# EAGLE design schematic (EAGLE 6.4)
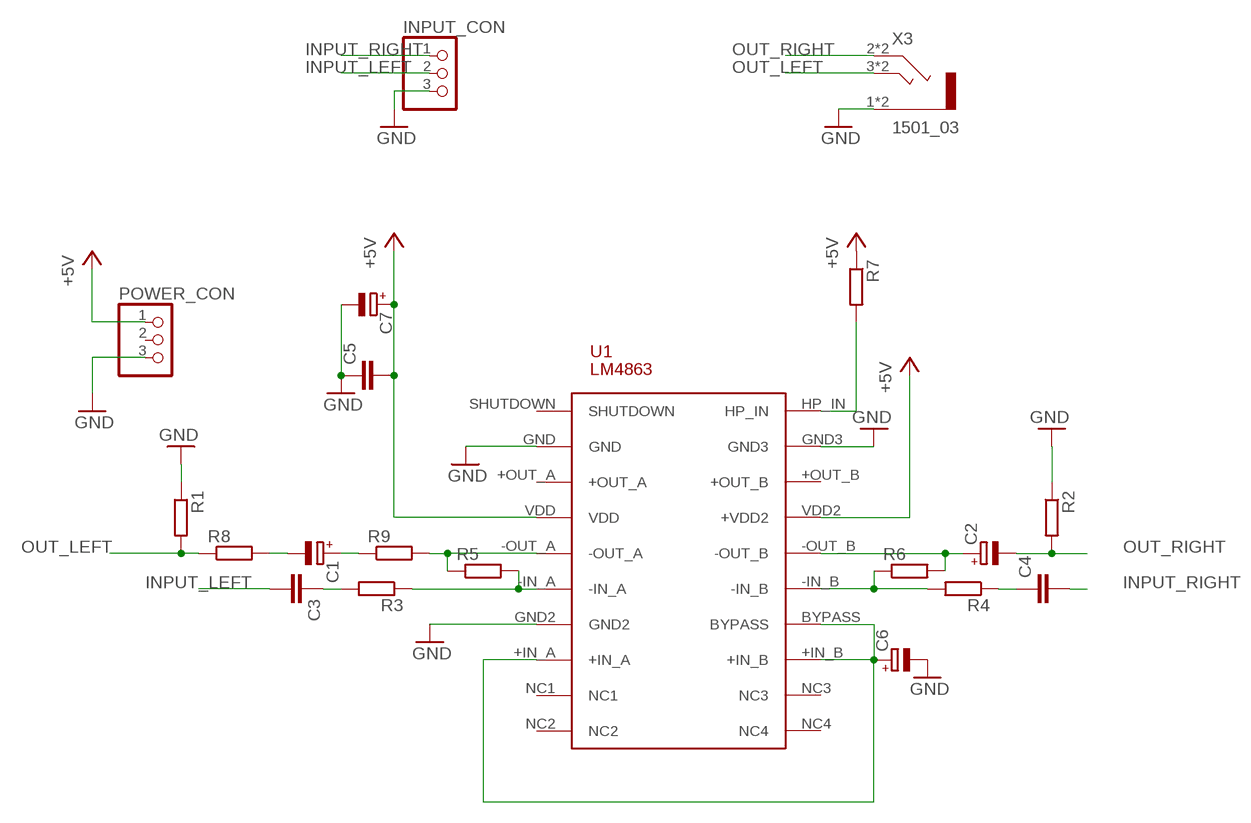
[diagram p0: schematic, sheet 1]

## Parts
C1  CPOL-EUE2.5-7  [E2,5-7]
C2  CPOL-EUE2.5-7  [E2,5-7]
C3  C-EU050-035X075  [C050-035X075]
C4  C-EU050-035X075  [C050-035X075]
C5  C-EU050-024X044  [C050-024X044]
C6  CPOL-EUE2.5-7  [E2,5-7]
C7  CPOL-EUE2.5-7  [E2,5-7]
INPUT_CON  PINHD-1X3CB  [1X03-CLEANBIG]
POWER_CON  PINHD-1X3  [1X03]
R1  R-EU_0207/2V  [0207/2V]
R2  R-EU_0207/10  [0207/10]
R3  R-EU_0207/10  [0207/10]
R4  R-EU_0207/2V  [0207/2V]
R5  R-EU_0204/2V  [0204V]
R6  R-EU_0207/2V  [0207/2V]
R7  R-EU_0207/10  [0207/10]
R8  R-EU_0204/7  [0204/7]
R9  R-EU_0204/7  [0204/7]
U1  LM4863  [TSSOP20]
X3  1501_03  [1501_03]

## Nets
+5V: C5.2 C7.+ POWER_CON.1 R7.1 U1.VDD U1.VDD2(+VDD2)
GND: C5.1 C6.- C7.- INPUT_CON.3 POWER_CON.3 R1.1 R2.1 U1.GND U1.GND2 U1.GND3 X3.1 X3.11
INPUT_LEFT: C3.2 INPUT_CON.2
INPUT_RIGHT: C4.2 INPUT_CON.1
N$1: C2.+ R6.2 U1.-OUT_B
N$2: R5.1 R9.2 U1.-OUT_A
N$3: C3.1 R3.2
N$4: R3.1 R5.2 U1.-IN_A
N$5: R4.2 R6.1 U1.-IN_B
N$6: C4.1 R4.1
N$7: C6.+ U1.+IN_A U1.+IN_B U1.BYPASS
N$8: R7.2 U1.HP_IN
N$9: C1.- R8.2
N$10: C1.+ R9.1
OUT_LEFT: R1.2 R8.1 X3.3 X3.33
OUT_RIGHT: C2.- R2.2 X3.2 X3.22
Unconnected: POWER_CON.2 U1.+OUT_A U1.+OUT_B U1.NC1 U1.NC2 U1.NC3 U1.NC4 U1.SHUTDOWN

## Library data of the parts
C1 C2 C7 = rcl:CPOL-EU: POLARIZED CAPACITOR, European symbol
C3-C5 = resistor:C-EU: CAPACITOR, European symbol
C6 = resistor:CPOL-EU: POLARIZED CAPACITOR, European symbol
INPUT_CON POWER_CON = adafruit:PINHD-1X3: PIN HEADER
R1-R9 = resistor:R-EU_: RESISTOR, European symbol
U1 = mylib:LM4863
X3 = mylib:1501_03: Klinkensteckverbinder nach JISC 6560, 2,5 mm Jack connectors according to JISC 6560, 2.5 mm Source: http://www.lumberg.com/Produkte/PDFs/1501_03.pdf; OC_FARNELL: 1200127; OC_NEWARK: unknown

## Board
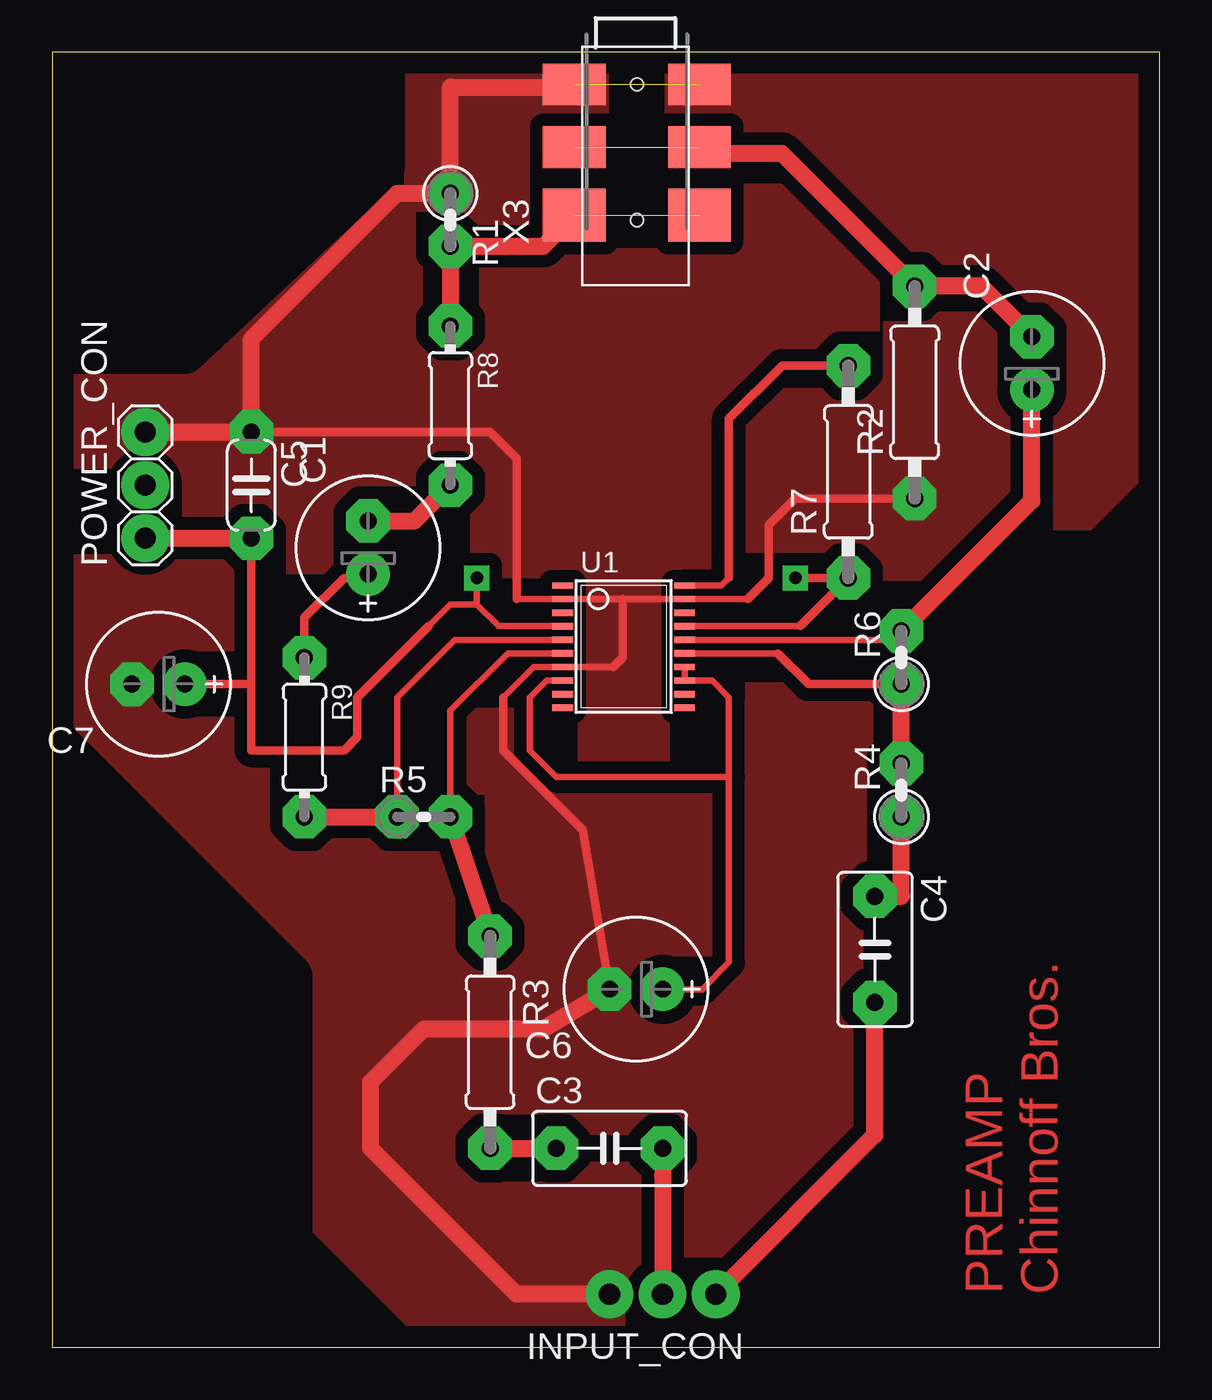
[diagram p1: board, top side]
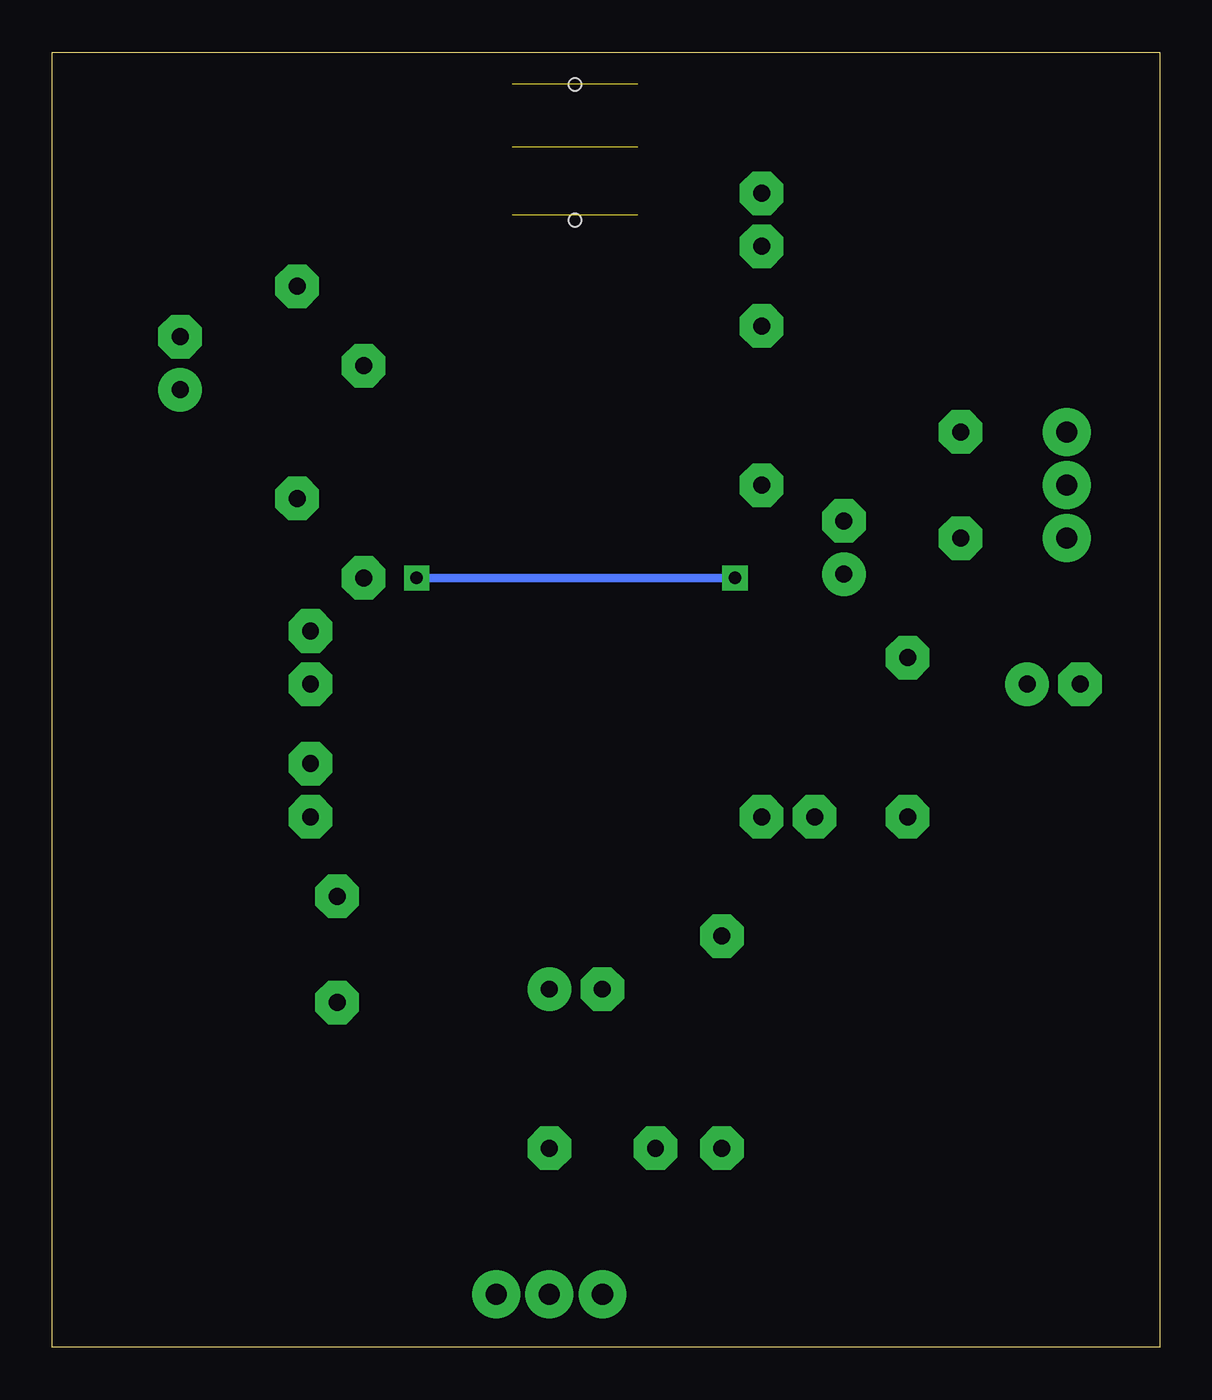
[diagram p2: board, bottom side, seen from below]

Size 53 x 62 mm. Coordinates in mm from the lower left corner, seen from the top.
Outline: 0,0 53,0 53,62 0,62 0,0
Copper layers (1*16): Top 0.035mm / dielectric 1.5mm / Bottom 0.035mm
Design rules "default *": minimum track width 10mil, minimum drill 0.9mm, track to track 12mil, track to pad 12mil, pad to pad 12mil, via to via 12mil, smd to smd 8mil, copper to edge 40mil, drill to drill 40mil, minimum pad ring 25mil, minimum via ring 12mil, stop-mask expansion 4mil, vias tented up to drill 0mil, thermal gap 20mil
tRestrict: area -2.5,47.6 to 15.9,64.8; area -3.8,-1.9 to 18.4,32.4; area 34.3,-1.3 to 59.7,42.5

### Footprints (pad centres in the part's own frame; a part is rotated, then mirrored left to right if it is on the bottom)
E2,5-7 = drill 0.813 pad 1.6: + -1.27,0 | drill 0.813 pad 1.6 octagon: - 1.27,0
C050-035X075 = drill 0.813 octagon: 1 -2.54,0; 2 2.54,0
C050-024X044 = drill 0.813 octagon: 1 -2.54,0; 2 2.54,0
1X03-CLEANBIG = drill 1.016 pad 1.676: 1 -2.54,0; 2 0,0; 3 2.54,0
1X03 = drill 1.016: 1 -2.54,0; 2 0,0; 3 2.54,0
0207/2V = drill 0.813 octagon: 1 -1.27,0; 2 1.27,0
0207/10 = drill 0.813 octagon: 1 -5.08,0; 2 5.08,0
0204V = drill 0.813 octagon: 1 -1.27,0; 2 1.27,0
0204/7 = drill 0.813 octagon: 1 -3.81,0; 2 3.81,0
TSSOP20 = smd 0.305 x 0.991: +IN_A 1.625,-2.918; +IN_B 1.625,2.918; +OUT_A -1.625,-2.918; +OUT_B -1.625,2.918; -IN_A 0.325,-2.918; -IN_B 0.325,2.918; -OUT_A -0.325,-2.918; -OUT_B -0.325,2.918; BYPASS 0.975,2.918; GND -2.275,-2.918; GND2 0.975,-2.918; GND3 -2.275,2.918; HP_IN -2.925,2.918; NC1 2.275,-2.918; NC2 2.925,-2.918; NC3 2.275,2.918; NC4 2.925,2.918; SHUTDOWN -2.925,-2.918; VDD -0.975,-2.918; VDD2 -0.975,2.918
1501_03 = smd 3 x 2: 1 3,0; 2 3,-3; 11 -3,0; 22 -3,-3 | smd 3 x 2.54: 3 3,-6.27; 33 -3,-6.27 | hole 0.6: 0,0; 0,-6.5

### Placement (x,y rotation side)
C1  15.12,38.28 90 top
C2  46.88,47.11 90 top
C3  26.67,9.53 0 top
C4  39.37,19.05 270 top
C5  9.53,41.27 270 top
C6  27.94,17.14 180 top
C7  5.08,31.75 180 top
INPUT_CON  29.21,2.54 180 top
POWER_CON  4.45,41.27 90 top
R1  19.05,53.98 270 top
R2  41.27,45.72 90 top
R3  20.95,14.61 270 top
R4  40.64,26.67 90 top
R5  17.78,25.4 0 top
R6  40.64,33.02 90 top
R7  38.1,41.91 90 top
R8  19.05,45.09 270 top
R9  12.06,29.21 270 top
U1  27.34,33.55 270 top
X3  27.98,60.46 0 top

### Tracks (layer width: path | path; a pad name or v marks a point on that pad's centre or on a via)
+5V  (via drill 0.6)
  Top 0.305: U1.VDD2 35.79,34.52 | U1.VDD 21.36,34.52 20.32,35.56 | 20.32,35.56 v20.32,36.83 | 20.32,35.56 19.05,35.56 18.01,34.52
  Top 0.406: 35.79,34.52 R7.1 v35.56,36.83 | C5.2 9.53,31.75 | 9.53,31.75 9.53,28.57 13.97,28.57 14.61,29.21 14.61,31.11 18.01,34.52 | C7.+ 9.53,31.75
  Top 0.813: POWER_CON.1 C5.2
  Bottom 0.406: v20.32,36.83 v35.56,36.83
GND  (1 unrouted)
  Top 0.305: 22.23,35.82 U1.GND 27.3,35.82 U1.GND3 33.28,35.82 | 26.86,32.57 U1.GND2 23.05,32.57 21.59,31.11
  Top 0.406: C5.1 20.95,43.81 22.23,42.55 22.23,35.82 | 33.28,35.82 34.29,36.83 34.29,39.37 35.56,40.64 R2.1 | 26.86,32.57 27.3,33.02 27.3,35.82 | 21.59,31.11 21.59,28.57 25.4,24.77 C6.-
  Top 0.813: X3.11 24.98,60.33 19.05,60.33 R1.1 16.51,55.24 9.53,48.26 C5.1 POWER_CON.3 | INPUT_CON.3 22.23,2.54 15.24,9.53 15.24,12.7 17.78,15.24 23.5,15.24 C6.-
  pour Top (isolate 0.61, no thermals): -2.54,64.77 56.52,64.77 56.52,63.5 56.52,-2.54 -2.54,-2.54 -2.54,-1.27
INPUT_LEFT
  Top 0.813: C3.2 29.21,8.26 INPUT_CON.2
INPUT_RIGHT
  Top 0.813: INPUT_CON.1 39.37,10.16 C4.2
N$1
  Top 0.305: U1.-OUT_B 40.22,33.87
  Top 0.406: 40.22,33.87 R6.2
  Top 0.813: R6.2 46.88,40.53 C2.+
N$2
  Top 0.305: U1.-OUT_A 19.27,33.87 16.51,31.11 R5.1
  Top 0.813: R9.2 R5.1
N$3
  Top 0.813: R3.2 C3.1
N$4
  Top 0.305: U1.-IN_A 21.79,33.22 19.05,30.48 R5.2
  Top 0.813: R5.2 R3.1
N$5
  Top 0.305: U1.-IN_B 34.73,33.22
  Top 0.406: 34.73,33.22 36.2,31.75 R6.1
  Top 0.813: R4.2 R6.1
N$6
  Top 0.813: C4.1 40.64,21.59 R4.1
N$7
  Top 0.305: U1.BYPASS U1.+IN_B 31.58,31.92 32.38,31.11 32.38,27.3 | U1.+IN_A 23.66,31.92 22.86,31.11 22.86,28.57 24.13,27.3 32.38,27.3 | C6.+ 31.11,17.14 32.38,18.41 32.38,27.3
N$8
  Top 0.305: U1.HP_IN 32.02,36.47 32.38,36.83
  Top 0.406: 32.38,36.83 32.38,44.45 34.92,46.99 R7.2
N$9
  Top 0.813: C1.- 17.33,39.55 R8.2
N$10
  Top 0.406: R9.1 12.06,34.92 13.97,36.83 14.93,36.83 C1.+
OUT_LEFT  (1 unrouted)
  Top 0.813: X3.33 23.5,52.7 R1.2 R8.1
OUT_RIGHT  (1 unrouted)
  Top 0.813: C2.- 44.46,50.8 R2.2 34.92,57.15 31.29,57.15 X3.2

### Text on the board
Top: PREAMP / Chinnoff Bros.